# Altium schematic sheet ModuleManHinhLCD1602.SchDoc
size A
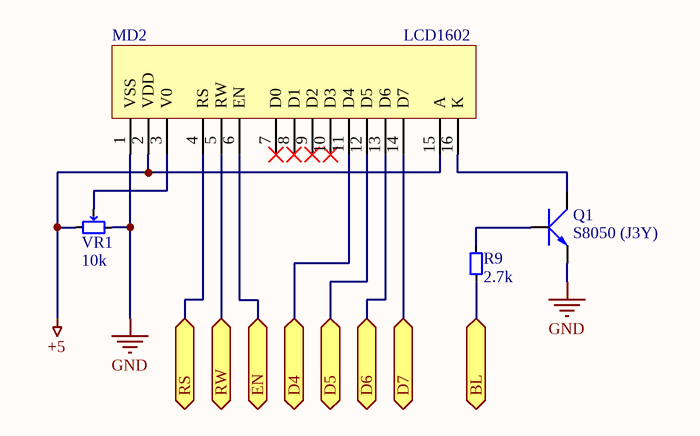
[diagram p0: ModuleManHinhLCD1602.SchDoc]

## Parts
MD2  LCD1602  [LCD1602-A]
Q1  S8050 (J3Y)  [SOT23]
R9  2.7k  [R-0805]
VR1  10k  [VR-ADJ-3362P]

## Ports
BL (bidir), D4 (bidir), D5 (bidir), D6 (bidir), D7 (bidir), EN (bidir), RS (bidir), RW (bidir)

## Nets
+5: MD2.2(VDD) MD2.15(A) VR1.3
GND: MD2.1(VSS) Q1.2(E) VR1.1
BL: R9.1 ; port BL
D4: MD2.11(D4) ; port D4
D5: MD2.12(D5) ; port D5
D6: MD2.13(D6) ; port D6
D7: MD2.14(D7) ; port D7
EN: MD2.6(EN) ; port EN
RS: MD2.4(RS) ; port RS
RW: MD2.5(RW) ; port RW
NetMD2_3: MD2.3(V0) VR1.2
NetMD2_16: MD2.16(K) Q1.3(C)
NetQ1_1: Q1.1(B) R9.2

Not connected (* = marked no-connect by the designer): MD2 7(D0)* 8(D1)* 9(D2)* 10(D3)*

## Library data of the parts
MD2 = LCD1602: Module Man Hinh LCD1602
Q1 = S8050 (J3Y): Transistor NPN 0.5A
R9 = RES: Cac Loai Dien Tro
VR1 = VRES: Cac Loai Bien Tro